# Altium project tsac-distribution.PrjPcb (part 1 of 2)
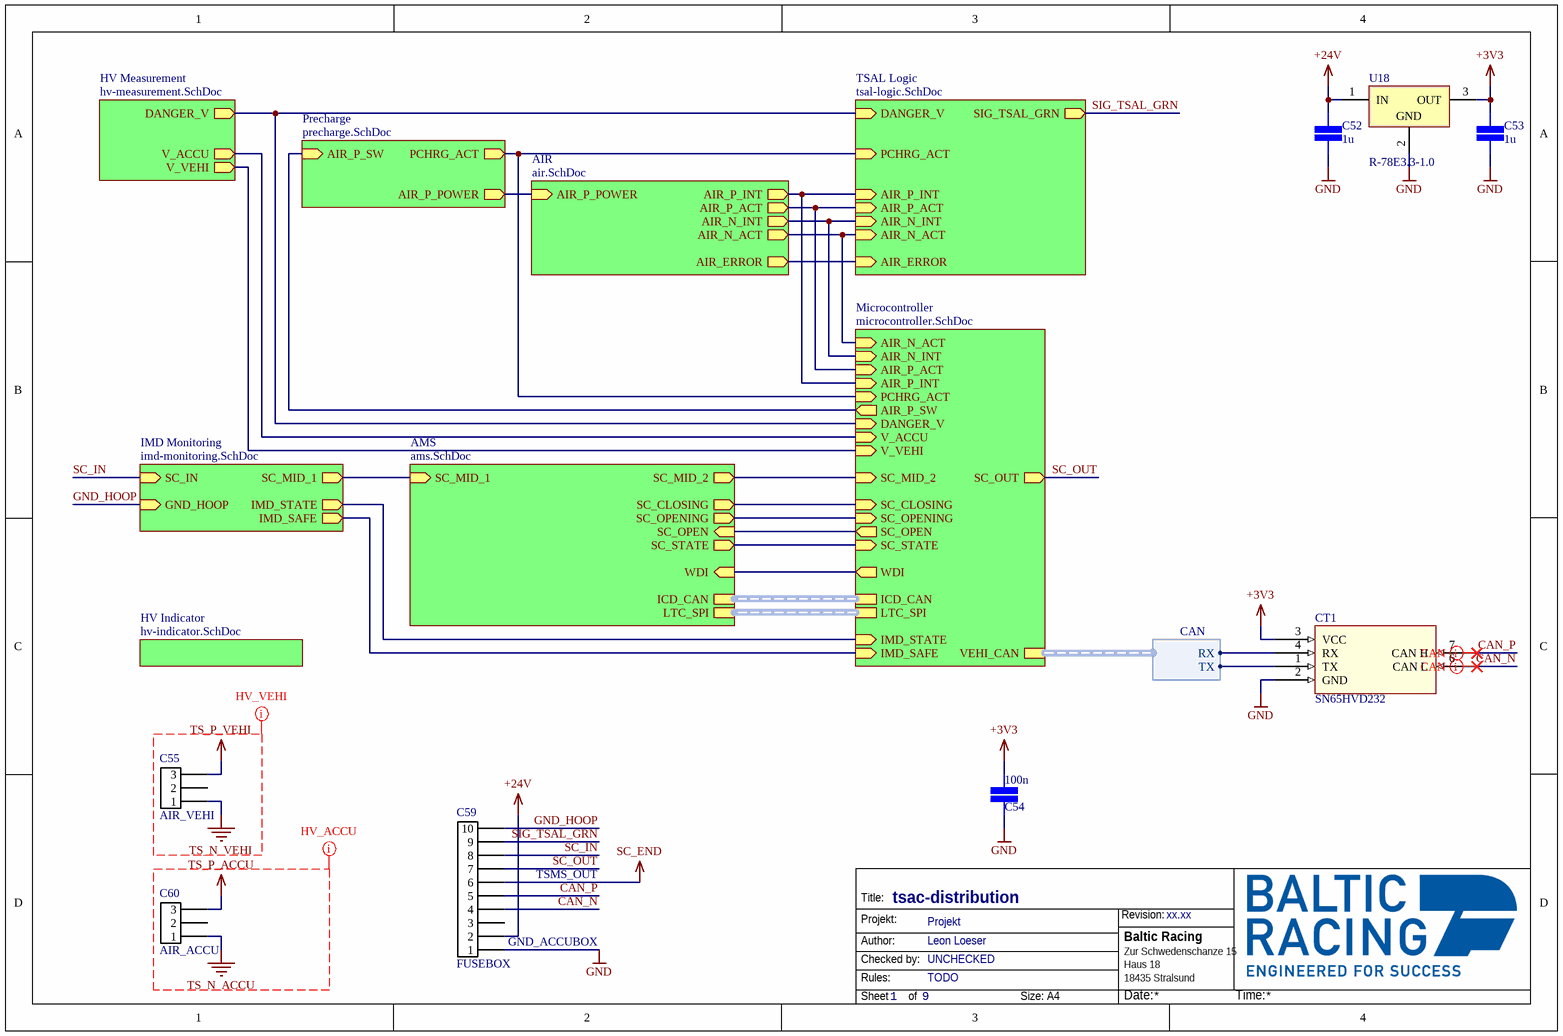
[diagram p0: tsac-distribution.SchDoc]
BoardName: tsac-distribution-board; BoardRevision: 1.0; Organization: Baltic Racing
9 sheets, 218 parts. Net scope: hierarchical (ports join the sheet entries above them; power ports are global).
Board file: tsac-distribution.PcbDoc
Sheets:
  tsac-distribution.SchDoc
    AIR = air.SchDoc
    AMS = ams.SchDoc
    HV Measurement = hv-measurement.SchDoc
    IMD Monitoring = imd-monitoring.SchDoc
    Microcontroller = microcontroller.SchDoc
    TSAL Logic = tsal-logic.SchDoc
    Precharge = precharge.SchDoc
    HV Indicator = hv-indicator.SchDoc

## Sheet tsac-distribution.SchDoc: tsac-distribution
size A4; Date: 05.10.2017; CheckedBy: UNCHECKED; Author: Leon Loeser; Organization: Baltic Racing; Address1: Zur Schwedenschanze 15; Address2: Haus 18; Address3: 18435 Stralsund; Revision: xx.xx; SheetNumber: 1; SheetTotal: 9; Rules: TODO; ProjectName: Projekt

### Parts
C52  value 1u  [CAP 0805/2012]  (hidden comment: SMD Capacitor)
C53  value 1u  [CAP 0805/2012]  (hidden comment: SMD Capacitor)
C54  value 100n  [CAP 0603/1608]  (hidden comment: SMD Capacitor)
C55  AIR_VEHI  [43650-0315]
C59  FUSEBOX  [43045-1012]
C60  AIR_ACCU  [43650-0315]
CT1  SN65HVD232  [SOIC8 CAN-Transceiver]
U18  R-78E3.3-1.0  [SIP3_RECOM]

### Sub-sheets
AIR = air.SchDoc: AIR_P_INT (out), AIR_N_INT (out), AIR_P_POWER (in), AIR_P_ACT (out), AIR_N_ACT (out), AIR_ERROR (out)
AMS = ams.SchDoc: SC_CLOSING (out), SC_OPEN (in), WDI (in), SC_OPENING (out), SC_STATE (out), SC_MID_1 (in), SC_MID_2 (out), ICD_CAN (harness CAN), LTC_SPI (harness SPI)
HV Indicator = hv-indicator.SchDoc: no entries
HV Measurement = hv-measurement.SchDoc: DANGER_V (out), V_ACCU (out), V_VEHI (out)
IMD Monitoring = imd-monitoring.SchDoc: SC_IN (in), IMD_STATE (out), GND_HOOP (in), SC_MID_1 (out), IMD_SAFE (out)
Microcontroller = microcontroller.SchDoc: SC_OPEN (out), SC_CLOSING (in), SC_OPENING (in), ICD_CAN (harness CAN), LTC_SPI (harness SPI), VEHI_CAN (harness CAN), SC_STATE (in), WDI (out), IMD_SAFE (in), IMD_STATE (in), PCHRG_ACT (in), DANGER_V (in), AIR_P_INT (in), AIR_P_ACT (in), AIR_N_INT (in), AIR_N_ACT (in), V_ACCU (in), V_VEHI (in), AIR_P_SW (out), SC_MID_2 (in), SC_OUT (out)
Precharge = precharge.SchDoc: PCHRG_ACT (out), AIR_P_POWER (out), AIR_P_SW (in)
TSAL Logic = tsal-logic.SchDoc: SIG_TSAL_GRN (out), PCHRG_ACT (in), DANGER_V (in), AIR_P_INT (in), AIR_P_ACT (in), AIR_N_INT (in), AIR_N_ACT (in), AIR_ERROR (in)

### Harnesses
CAN: TX, RX

### Nets
+3V3: C53.1 C54.1 CT1.3(VCC) U18.3(OUT)
+24V: C52.1 C59.2 U18.1(IN)
GND: C52.2 C53.2 C54.2 C59.1 CT1.2(GND) U18.2(GND)
SC_END: C59.6
TS_N_ACCU: C60.1
TS_N_VEHI: C55.1
TS_P_ACCU: C60.3
TS_P_VEHI: C55.3
AIR_ERROR: sheet AIR/AIR_ERROR, sheet TSAL Logic/AIR_ERROR
AIR_N_ACT: sheet AIR/AIR_N_ACT, sheet Microcontroller/AIR_N_ACT, sheet TSAL Logic/AIR_N_ACT
AIR_N_INT: sheet AIR/AIR_N_INT, sheet Microcontroller/AIR_N_INT, sheet TSAL Logic/AIR_N_INT
AIR_P_ACT: sheet AIR/AIR_P_ACT, sheet Microcontroller/AIR_P_ACT, sheet TSAL Logic/AIR_P_ACT
AIR_P_INT: sheet AIR/AIR_P_INT, sheet Microcontroller/AIR_P_INT, sheet TSAL Logic/AIR_P_INT
AIR_P_POWER: sheet AIR/AIR_P_POWER, sheet Precharge/AIR_P_POWER
CAN_N: C59.4 CT1.6(CAN_L)
CAN_P: C59.5 CT1.7(CAN_H)
CANRX0: CT1.4(RX) ; sheet Microcontroller/VEHI_CAN.RX
CANTX0: CT1.1(TX) ; sheet Microcontroller/VEHI_CAN.TX
DANGER_V: sheet HV Measurement/DANGER_V, sheet Microcontroller/DANGER_V, sheet TSAL Logic/DANGER_V
GND_HOOP: C59.10 ; sheet IMD Monitoring/GND_HOOP
IMD_SC_CLOSED: sheet IMD Monitoring/IMD_SAFE, sheet Microcontroller/IMD_SAFE
IMD_STATE: sheet IMD Monitoring/IMD_STATE, sheet Microcontroller/IMD_STATE
PCHRG_ACT: sheet Microcontroller/PCHRG_ACT, sheet TSAL Logic/PCHRG_ACT, sheet Precharge/PCHRG_ACT
SC_IN: C59.8 ; sheet IMD Monitoring/SC_IN
SC_OUT: C59.7 ; sheet Microcontroller/SC_OUT
SIG_TSAL_GRN: C59.9 ; sheet TSAL Logic/SIG_TSAL_GRN
V_ACCU: sheet HV Measurement/V_ACCU, sheet Microcontroller/V_ACCU
V_VEHI: sheet HV Measurement/V_VEHI, sheet Microcontroller/V_VEHI
WDI: sheet AMS/WDI, sheet Microcontroller/WDI
NetD3_2: sheet AMS/SC_CLOSING, sheet Microcontroller/SC_CLOSING
NetD4_1: sheet AMS/SC_STATE, sheet Microcontroller/SC_STATE
NetD5_1: sheet AMS/SC_OPEN, sheet Microcontroller/SC_OPEN
NetD7_1: sheet AMS/SC_OPENING, sheet Microcontroller/SC_OPENING
NetQ4_3: sheet AMS/SC_MID_1, sheet IMD Monitoring/SC_MID_1
NetQ6_3: sheet AMS/SC_MID_2, sheet Microcontroller/SC_MID_2
NetR19_1: sheet Microcontroller/AIR_P_SW, sheet Precharge/AIR_P_SW

Not connected (* = marked no-connect by the designer): C55 2; C59 3; C60 2; CT1 5(NC) 8(NC)

### Buses and harness runs
harness sheet AMS/ICD_CAN = sheet Microcontroller/ICD_CAN
harness sheet AMS/LTC_SPI = sheet Microcontroller/LTC_SPI

### Layout directives
differential pair: CAN_N, CAN_P
net class HV_VEHI: TS_N_VEHI, TS_P_VEHI
net class HV_ACCU: TS_N_ACCU, TS_P_ACCU

### Notes on the sheet
- TSMS_OUT
- GND_ACCUBOX
- Title:
- Projekt:
- Revision:
- Author:
- Rules:
- Checked by:
- Sheet
- of
- Size:
- A4
- Date:
- Time:

### Library data of the parts
C52 = SMD Capacitor: Capacitor with multiple Footprints; Voltage: 25V
C53 C54 = SMD Capacitor: Capacitor with multiple Footprints; Voltage: 6.3V
C55 C60 = MicroFit3.0 3-Pin: Molex MicroFit3.0 3-Pin
C59 = MicroFit3.0 10-Pin: Micro-Fit 3.0 10-Pin / 600V / 8.5V
CT1 = SN65HVD232: Standard CAN-Transciever 3.3V
U18 = R-78E3.3-1.0: Nonisolated 3.3V Switchmode converter

## Sheet air.SchDoc: air
size A4; Date: 05.10.2017; CheckedBy: Nico Bieberich; Author: Leon Loeser; Organization: Baltic Racing; Address1: Zur Schwedenschanze 15; Address2: Haus 18; Address3: 18435 Stralsund; Revision: xx.xx; SheetNumber: 7; SheetTotal: 9; Rules: TODO; ProjectName: Projekt
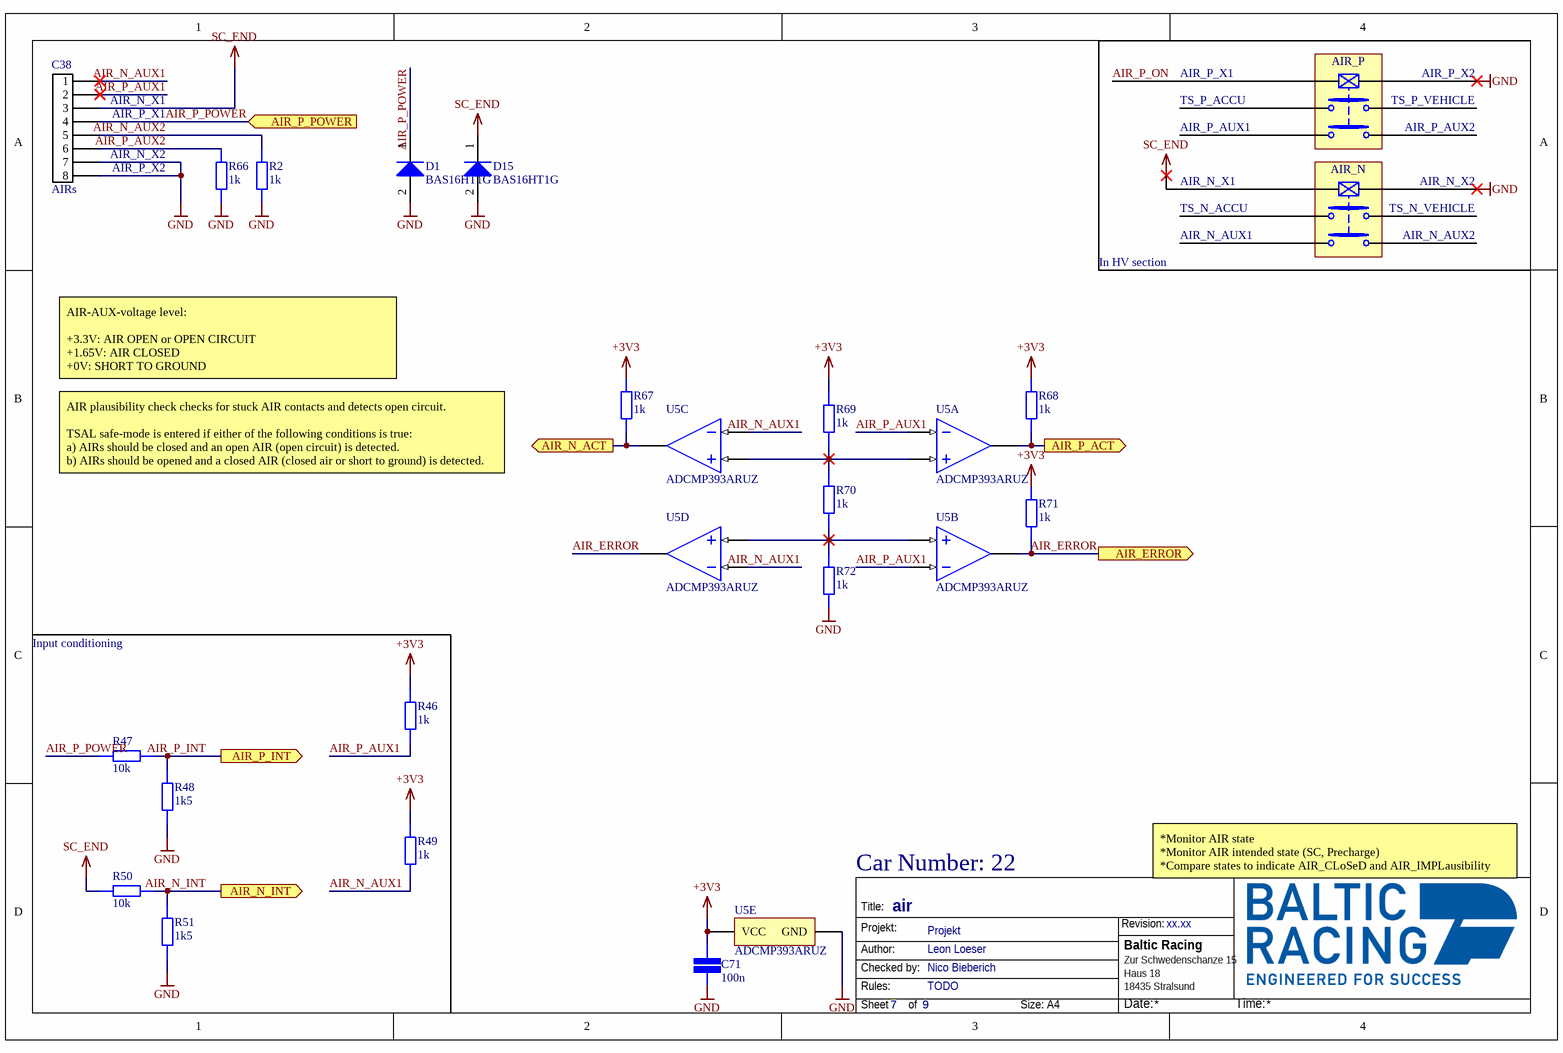
[diagram p1: air.SchDoc]

### Parts
C38  AIRs  [43045-0812]
C71  value 100n  [CAP 0603/1608]  (hidden comment: SMD Capacitor)
D1  BAS16HT1G  [ONSC-SOD-323-2-477-02_V]
D15  BAS16HT1G  [ONSC-SOD-323-2-477-02_V]
R2  value 1k  [STACKPOLE CSR0603]  (hidden comment: SMD Resistor)
R46  value 1k  [STACKPOLE CSR0603]  (hidden comment: SMD Resistor)
R47  value 10k  [STACKPOLE CSR0603]  (hidden comment: SMD Resistor)
R48  value 1k5  [STACKPOLE CSR0603]  (hidden comment: SMD Resistor)
R49  value 1k  [STACKPOLE CSR0603]  (hidden comment: SMD Resistor)
R50  value 10k  [STACKPOLE CSR0603]  (hidden comment: SMD Resistor)
R51  value 1k5  [STACKPOLE CSR0603]  (hidden comment: SMD Resistor)
R66  value 1k  [STACKPOLE CSR0603]  (hidden comment: SMD Resistor)
R67  value 1k  [STACKPOLE CSR0603]  (hidden comment: SMD Resistor)
R68  value 1k  [STACKPOLE CSR0603]  (hidden comment: SMD Resistor)
R69  value 1k  [STACKPOLE CSR0603]  (hidden comment: SMD Resistor)
R70  value 1k  [STACKPOLE CSR0603]  (hidden comment: SMD Resistor)
R71  value 1k  [STACKPOLE CSR0603]  (hidden comment: SMD Resistor)
R72  value 1k  [STACKPOLE CSR0603]  (hidden comment: SMD Resistor)
U5  ADCMP393ARUZ  [ANALOG_RU14]  (parts A,B,C,D,E of 5)

### Ports
AIR_ERROR (out), AIR_N_ACT (out), AIR_N_INT (out), AIR_P_ACT (out), AIR_P_INT (out), AIR_P_POWER (in)

### Nets
+3V3: C71.1 R46.2 R49.2 R67.2 R68.2 R69.2 R71.2 U5.3(VCC)
GND: C38.7 C38.8 C71.2 D1.2(A) D15.2(A) R2.1 R48.1 R51.1 R66.1 R72.1 U5.12(GND)
SC_END: C38.3 D15.1(K) R50.2
AIR_ERROR: R71.1 U5.1(OUT_B) U5.13(OUT_D) ; port AIR_ERROR
AIR_N_ACT: R67.1 U5.14(OUT_C) ; port AIR_N_ACT
AIR_N_AUX1: C38.1 R49.1 U5.8(-IN_C) U5.10(-IN_D)
AIR_N_AUX2: C38.5 R2.2
AIR_N_INT: R50.1 R51.2 ; port AIR_N_INT
AIR_P_ACT: R68.1 U5.2(OUT_A) ; port AIR_P_ACT
AIR_P_AUX1: C38.2 R46.1 U5.4(-IN_A) U5.6(-IN_B)
AIR_P_AUX2: C38.6 R66.2
AIR_P_INT: R47.1 R48.2 ; port AIR_P_INT
AIR_P_POWER: C38.4 D1.1(K) R47.2 ; port AIR_P_POWER
NetR69_1: R69.1 R70.2 U5.5(+IN_A) U5.9(+IN_C)
NetR70_1: R70.1 R72.2 U5.7(+IN_B) U5.11(+IN_D)

### Notes on the sheet
- (near C38) AIR_N_X1
- AIR_P_X1
- AIR_P_ON
- TS_P_ACCU
- AIR_P
- TS_P_VEHICLE
- AIR_P_X2
- AIR_N_X2
- AIR_P_AUX1
- AIR_N_X1
- AIR_N
- AIR_P_AUX2
- TS_N_ACCU
- AIR_N_AUX1
- TS_N_VEHICLE
- AIR_N_AUX2
- In HV section
- AIR-AUX-voltage level:
  +3.3V: AIR OPEN or OPEN CIRCUIT
  +1.65V: AIR CLOSED
  +0V: SHORT TO GROUND
- AIR plausibility check checks for stuck AIR contacts and detects open circuit.
  TSAL safe-mode is entered if either of the following conditions is true:
  a) AIRs should be closed and an open AIR (open circuit) is detected.
  b) AIRs should be opened and a closed AIR (closed air or short to ground) is detected.
- Input conditioning
- Car Number: 22
- *Monitor AIR state
  *Monitor AIR intended state (SC, Precharge)
  *Compare states to indicate AIR_CLoSeD and AIR_IMPLausibility
  *Generate SIG_TSAL
- Labels drawn without touching a wire or pin: GND, SC_END
- Title:
- Projekt:
- Revision:
- Author:
- Rules:
- Checked by:
- Sheet
- of
- Size:
- A4
- Date:
- Time:

### Library data of the parts
C38 = MicroFit3.0 8-Pin: Molex Micro-Fit 3.0 8-Pin / 600V / 8.5V
C71 = SMD Capacitor: Capacitor with multiple Footprints
D1 D15 = CMP-1054-00068-1: Switching Diode, 2-Pin SOD-323, Pb-Free, Tape and Reel; Manufacturer: On Semiconductor; Configuration: Single; IF Max (A): 0.2; trr Max (ns): 6; Packing: Tape and Reel; ComponentLink2URL: http://www.onsemi.com/pub_link/Collateral/BAS16HT1-D.PDF; ComponentLink3Description: Package Specification; RoHS: TRUE; PackageDescription: 2-Pin SOD, Body 1.7 x 1.25 mm; PackageReference: SOD-323-2-477-02; PartNumber: BAS16HT1G; ComponentLink1URL: http://www.onsemi.com/; Mounting Technology: Surface Mount; ComponentLink1Description: Manufacturer URL; ComponentLink2Description: Datasheet; DatasheetVersion: Rev. 11; PackageVersion: Rev. H, 03/2007; ComponentLink3URL: http://www.onsemi.com/pub_link/Collateral/477-02.PDF.1
R2 R46-R51 R66-R72 = SMD Resistor: Resistor with multiple footprints
U5 = ADCMP393ARUZ: 2.3V-5.5V Quad Comparator With Known Power-Up State and Open-Drain output

## Sheet ams.SchDoc: ams-master
size A4; Date: 05.10.2017; CheckedBy: UNCHECKED; Author: Leon Loeser; Organization: Baltic Racing; Address1: Zur Schwedenschanze 15; Address2: Haus 18; Address3: 18435 Stralsund; Revision: xx.xx; SheetNumber: 2; SheetTotal: 9; Rules: EV5.8; ProjectName: Projekt
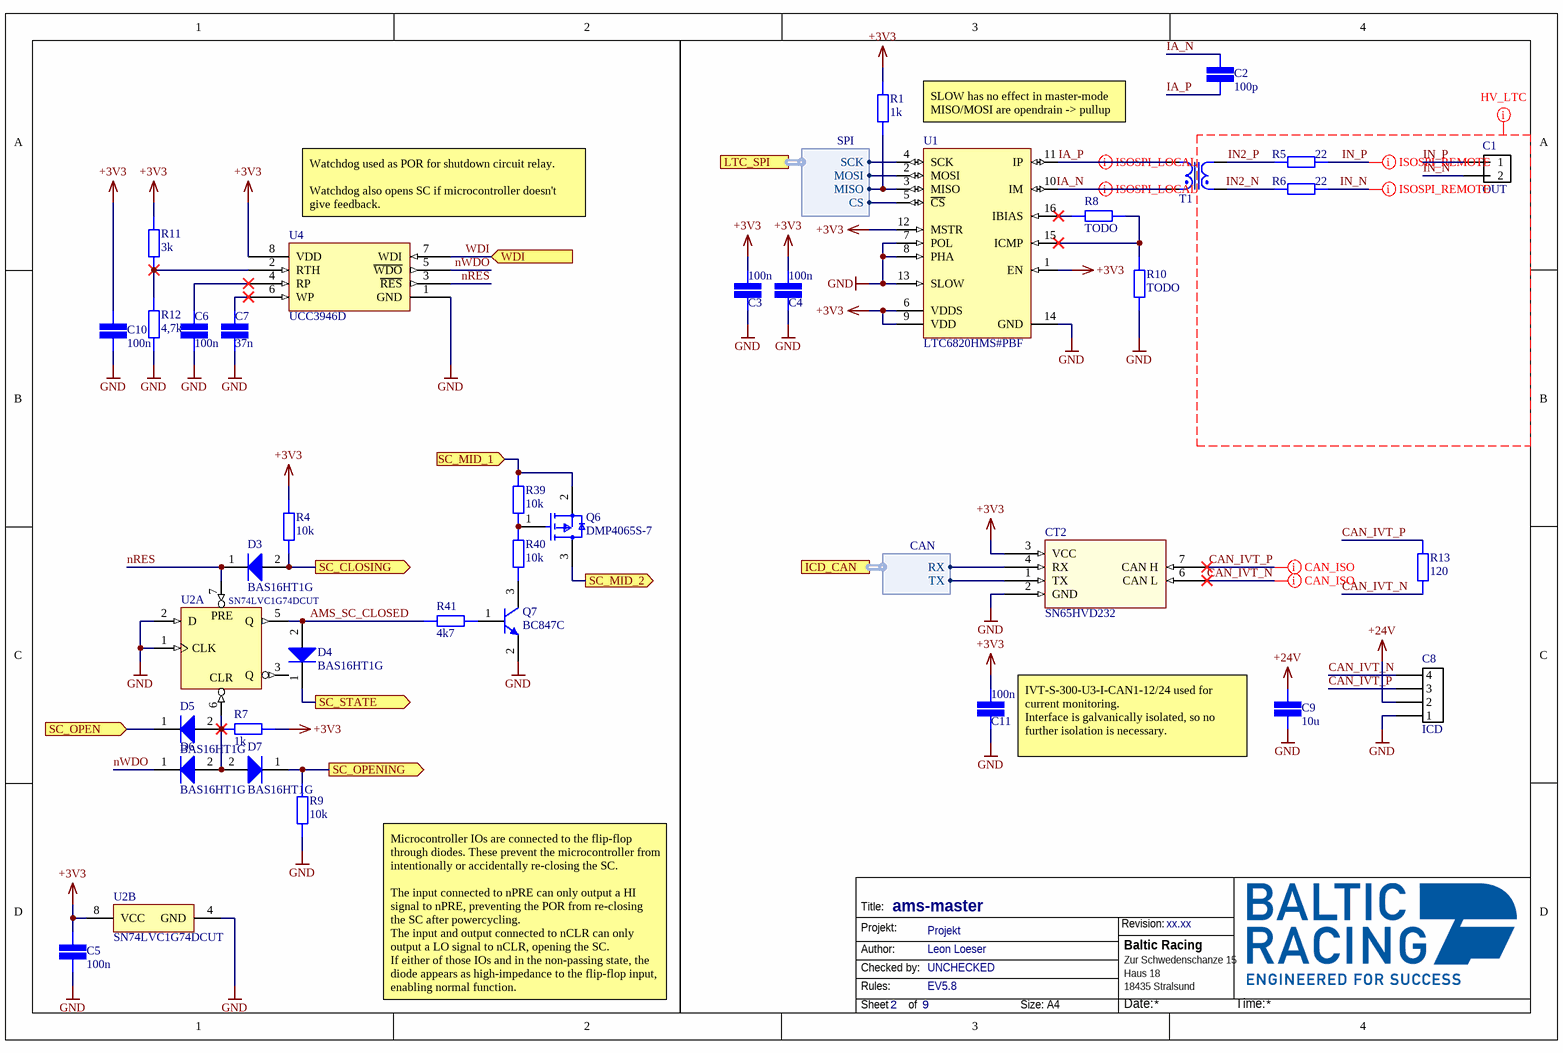
[diagram p2: ams.SchDoc]

### Parts
C1  OUT  [43045-0212]
C2  value 100p  [CAP 0603/1608]  (hidden comment: SMD Capacitor)
C3  value 100n  [CAP 0603/1608]  (hidden comment: SMD Capacitor)
C4  value 100n  [CAP 0603/1608]  (hidden comment: SMD Capacitor)
C5  value 100n  [CAP 0603/1608]  (hidden comment: SMD Capacitor)
C6  value 100n  [CAP 0603/1608]  (hidden comment: SMD Capacitor)
C7  value 37n  [CAP 0603/1608]  (hidden comment: SMD Capacitor)
C8  ICD  [43045-0412]
C9  value 10u  [CAP 1206/3216]  (hidden comment: SMD Capacitor)
C10  value 100n  [CAP 0603/1608]  (hidden comment: SMD Capacitor)
C11  value 100n  [CAP 0603/1608]  (hidden comment: SMD Capacitor)
CT2  SN65HVD232  [SOIC8 CAN-Transceiver]
D3  BAS16HT1G  [ONSC-SOD-323-2-477-02_V]
D4  BAS16HT1G  [ONSC-SOD-323-2-477-02_V]
D5  BAS16HT1G  [ONSC-SOD-323-2-477-02_V]
D6  BAS16HT1G  [ONSC-SOD-323-2-477-02_V]
D7  BAS16HT1G  [ONSC-SOD-323-2-477-02_V]
Q6  DMP4065S-7  [FP-SOT23-MFG]
Q7  BC847C  [INF-SOT23_L]
R1  value 1k  [STACKPOLE CSR0603]  (hidden comment: SMD Resistor)
R4  value 10k  [STACKPOLE CSR0603]  (hidden comment: SMD Resistor)
R5  value 22  [STACKPOLE CSR0603]  (hidden comment: SMD Resistor)
R6  value 22  [STACKPOLE CSR0603]  (hidden comment: SMD Resistor)
R7  value 1k  [STACKPOLE CSR0603]  (hidden comment: SMD Resistor)
R8  value TODO  [STACKPOLE CSR0603]  (hidden comment: SMD Resistor)
R9  value 10k  [STACKPOLE CSR0603]  (hidden comment: SMD Resistor)
R10  value TODO  [STACKPOLE CSR0603]  (hidden comment: SMD Resistor)
R11  value 3k  [STACKPOLE CSR0603]  (hidden comment: SMD Resistor)
R12  value 4,7k  [STACKPOLE CSR0603]  (hidden comment: SMD Resistor)
R13  value 120  [STACKPOLE CSR0603]  (hidden comment: SMD Resistor)
R39  value 10k  [STACKPOLE CSR0603]  (hidden comment: SMD Resistor)
R40  value 10k  [STACKPOLE CSR0603]  (hidden comment: SMD Resistor)
R41  value 4k7  [STACKPOLE CSR0603]  (hidden comment: SMD Resistor)
T1  750110055  [Wuerth_750110055]  (value not drawn)
U1  LTC6820HMS#PBF  [LT-MS-16_M]
U2  SN74LVC1G74DCUT  [DCU0008A_L]  (parts A,B of 2)
U4  UCC3946D  [SOIC8]

### Ports
ICD_CAN (harness CAN), LTC_SPI (harness SPI), SC_CLOSING (out), SC_MID_1 (in), SC_MID_2 (out), SC_OPEN (in), SC_OPENING (out), SC_STATE (out), WDI (in)

### Harnesses
SPI: SCK, MOSI, MISO, CS
CAN: TX, RX

### Nets
+3V3: C3.1 C4.1 C5.1 C10.2 C11.1 CT2.3(VCC) R1.2 R4.1 R7.2 R11.1 U1.1(EN) U1.6(VDDS) U1.9(VDD) U1.12(MSTR) U2.8(VCC) U4.8(VDD)
+24V: C8.2 C9.2
GND: C3.2 C4.2 C5.2 C6.1 C7.1 C8.1 C9.1 C10.1 C11.2 CT2.2(GND) Q7.2(E) R9.2 R10.1 R12.2 U1.7(POL) U1.8(PHA) U1.13(SLOW) U1.14(GND) U2.1(CLK) U2.2(D) U2.4(GND) U4.1(GND)
AMS_SC_CLOSED: D4.2(A) R41.2 U2.5(Q)
CAN_IVT_N: C8.4 CT2.6(CAN_L) R13.1
CAN_IVT_P: C8.3 CT2.7(CAN_H) R13.2
CANRX1: CT2.4(RX) ; port ICD_CAN.RX
CANTX1: CT2.1(TX) ; port ICD_CAN.TX
IA_N: C2.2 T1.1 U1.10(IM)
IA_P: C2.1 T1.2 U1.11(IP)
IN2_N: R6.1 T1.4
IN2_P: R5.1 T1.3
IN_N: C1.2 R6.2
IN_P: C1.1 R5.2
nRES: D3.1(K) U2.7(~{PRE}) U4.3(~{RES})
nWDO: D6.1(K) U4.5(~{WDO})
SPI3_MISO: R1.1 U1.3(MISO) ; port LTC_SPI.MISO
SPI3_MOSI: U1.2(MOSI) ; port LTC_SPI.MOSI
SPI3_NSS: U1.5(~{CS}) ; port LTC_SPI.CS
SPI3_SCK: U1.4(SCK) ; port LTC_SPI.SCK
WDI: U4.7(WDI) ; port WDI
NetC6_2: C6.2 U4.4(RP)
NetC7_2: C7.2 U4.6(WP)
NetD3_2: D3.2(A) R4.2 ; port SC_CLOSING
NetD4_1: D4.1(K) ; port SC_STATE
NetD5_1: D5.1(K) ; port SC_OPEN
NetD5_2: D5.2(A) D6.2(A) D7.2(A) R7.1 U2.6(~{CLR})
NetD7_1: D7.1(K) R9.1 ; port SC_OPENING
NetQ4_3: Q6.2(S) R39.1 ; port SC_MID_1
NetQ6_1: Q6.1(G) R39.2 R40.1
NetQ6_3: Q6.3(D) ; port SC_MID_2
NetQ7_1: Q7.1(B) R41.1
NetQ7_3: Q7.3(C) R40.2
NetR8_1: R8.1 R10.2 U1.15(ICMP)
NetR8_2: R8.2 U1.16(IBIAS)
NetR11_2: R11.2 R12.1 U4.2(RTH)

Not connected (* = marked no-connect by the designer): CT2 5(NC) 8(NC); U2 3(Q)

### Layout directives
differential pair: CAN_IVT_N, CAN_IVT_P, IA_N, IA_P, IN_N, IN_P
net class HV_LTC: IN2_N, IN2_P, IN_N, IN_P

### Notes on the sheet
- SLOW has no effect in master-mode
  MISO/MOSI are opendrain -> pullup
- (near U4) Watchdog used as POR for shutdown circuit relay.
  Watchdog also opens SC if microcontroller doesn't give feedback.
- IVT-S-300-U3-I-CAN1-12/24 used for current monitoring.
  Interface is galvanically isolated, so no further isolation is necessary.
- Microcontroller IOs are connected to the flip-flop through diodes. These prevent the microcontroller from intentionally or accidentally re-closing the SC.
  The input connected to nPRE can only output a HI signal to nPRE, preventing the POR from re-closing the SC after powercycling.
  The input and output connected to nCLR can only output a LO signal to nCLR, opening the SC.
  If either of those IOs and in the non-passing state, the diode appears as high-impedance to the flip-flop input, enabling normal function.
- Title:
- Projekt:
- Revision:
- Author:
- Rules:
- Checked by:
- Sheet
- of
- Size:
- A4
- Date:
- Time:
- (in symbol CMP-0859-00687-1, part A) PRE; CLR

### Library data of the parts
C1 = MicroFit3.0 2-Pin: Molex MicroFit3.0 2-Pin
C2-C7 C10 = SMD Capacitor: as C53 on sheet tsac-distribution
C8 = MicroFit3.0 4-Pin: Molex Micro-Fit 3.0 4-Pin / 600V / 8.5V
C9 C11 = SMD Capacitor: Capacitor with multiple Footprints
CT2 = SN65HVD232: Standard CAN-Transciever 3.3V
D3-D7 = CMP-1054-00068-1: as D1 on sheet air; Packing: Tape and Reel; ComponentLink2URL: http://www.onsemi.com/pub_link/Collateral/BAS16HT1-D.PDF; ComponentLink3Description: Package Specification; RoHS: TRUE; PackageDescription: 2-Pin SOD, Body 1.7 x 1.25 mm; PackageReference: SOD-323-2-477-02; PartNumber: BAS16HT1G; ComponentLink1URL: http://www.onsemi.com/; Mounting Technology: Surface Mount; ComponentLink1Description: Manufacturer URL; ComponentLink2Description: Datasheet; DatasheetVersion: Rev. 11; PackageVersion: Rev. H, 03/2007; ComponentLink3URL: http://www.onsemi.com/pub_link/Collateral/477-02.PDF.1
Q6 = CMP-12801-000050-1: MOSFET P-CH 40V 2.4A SOT23; Manufacturer: Diodes Inc.; Number Of Channels: 1; Max Junction Temp: +150°C; Standoff Height: 0.013mm; Power Dissipation: 0.72W; Turn Off Delay Time: 36.3ns; Rthja Max: 171°C/W; Typ Forward Diode Voltage: -0.7V; Max Forward Diode Voltage: -1.2V; Drain To Source Voltage: -40V; Threshold Vgs Min: -1V; Gate To Source Voltage: 20V; Depletion Mode: False; Input Capacitace At Vds: 587pF @ -20V; Drain To Source Resistance: 64mΩ; Turn On Delay Time: 3.6ns; Continuous Drain Current: -2.4A; Pulse Drain Current: -20A; Gate Charge At Vgs: 12.2nC @ -10V; Threshold Vgs Max: -3V; Octopart: https://octopart.com/dmp4065s-7-diodes+inc.-57605044; Footprint Url: https://www.diodes.com/assets/Package-Files/SOT23.pdf; Device Class L2: Transistors; Package: SOT23; Number Of P Channels: 1; ComponentLink2URL: https://www.diodes.com/assets/Datasheets/DMP4065S.pdf; Temperature Range High: +150°C; Device Class L1: Discrete Semiconductors; Temperature Range Low: -55°C; Manufacturer Part Number: DMP4065S-7; ComponentLink2Description: Datasheet; Lead Free: Yes; Temperature: -55°C to +150°C; Drain To Source Breakdown Voltage: -40V; Category: Trans; Height: 1.1mm; Digikey Description: MOSFET P-CH 40V 2.4A SOT23; Ipc Land Pattern Name: SOT92P240X102-3; Device Class L3: MOSFETs; RoHS: TRUE; Mouser Description: Trans MOSFET P-CH 40V 2.4A Automotive 3-Pin SOT-23 T/R; Automotive: No
Q7 = CMP-1177-00037-1: NPN Silicon AF Transistor, 45 V VCEO, 100 mA IC, SOT23, Reel, Green; Manufacturer: Infineon; VCEO (max): 45Â V; VEBO (max): 6Â V; fT (typ): 250Â MHz; VCBO (max): 50Â V; ICM (max): 200Â mA; Green: TRUE; IC (max): 100Â mA; Ptot (max): 330Â mW; ICBO (max): 15Â nA; PartNumber: BC847C; ComponentLink3URL: http://www.infineon.com/dgdl/SOT23-Package_Overview.pdf?folderId=db3a30431936bc4b0119532290053c66&fileId=db3a30431936bc4b0119533468123c85; ComponentLink3Description: Package Specification; Mounting Technology: Surface Mount; PackageDescription: 3-Pin Small Outline Transistor Package, 1.3 x 2.9 mm Body, 0.95 mm Pitch; PackageReference: SOT23; ComponentLink2URL: http://www.infineon.com/dgdl/bc847series_bc848series_bc849series_bc850series.pdf?folderId=db3a304314dca389011541d30fa21656&fileId=db3a304314dca389011541d4630a1657; ComponentLink2Description: Datasheet; ComponentLink1Description: Manufacturer URL; Polarity: NPN; ComponentLink1URL: http://www.infineon.com/; IBM (max): 200Â mA; Packing: Reel; PackageVersion: Apr-08
R1 R4-R13 R39-R41 = SMD Resistor: Resistor with multiple footprints
T1 = Wuerth_Transformer_750110055: Würth Toroid Transformer 1:1 70µH; Order Nr.: 750312504; Hersteller: Würth
U1 = CMP-0937-00009-1: IsoSPI Isolated Communication Interface, 2.7 to 5.5 V, -40 to 125 degC, 16-Pin MSOP (MS), Pb-Free; Manufacturer: Linear Technology; IO Supply Current: 1 uA Max.; IO Supply Voltage Range: 1.7 to 5.5 V; Receiver Input Resistance: 35 kOhm; VBIAS: 1.9 to 2.1 V; Supply Current, IDLE State: 2 uA; ComponentLink3Description: Package Specification; Mounting Technology: Surface Mount; ComponentLink2URL: http://cds.linear.com/docs/en/datasheet/6820fa.pdf; PackageVersion: Rev. A; PackageReference: MS-16; PackageDescription: 16-Pin Micro Small Outline Package, Body 4.039 x 3 mm, Pitch 0.5 mm; ComponentLink3URL: http://cds.linear.com/docs/en/packaging/05081669_A_MS16.pdf; DatasheetVersion: Rev. A; Power Supply: 2.7 to 5.5 V; ComponentLink1Description: Manufacturer URL; PartNumber: LTC6820HMS#PBF; Temperature Range (degC): -40 to 125; ComponentLink1URL: http://www.linear.com/; ComponentLink2Description: Datasheet
U2 = CMP-0859-00687-1: Single Positive-Edge-Triggered D-Type Flip-Flop With Clear and Preset, DCU0008A, SMALL T&R; Schmitt Trigger: No; Technology Family: LVC; VCC(Min)(V): 1.65; F @ Nom Voltage(Max)(Mhz): 150; ICC @ Nom Voltage(Max)(mA): 0.01; Voltage(Nom)(V): 1.8,2.5,3.3,5; VCC(Max)(V): 5.5; Output Type: CMOS; Logic: True; tpd @ Nom Voltage(Max)(ns): 13.4,7.1,5.9,4.1; Input Type: CMOS/TTL; Output Drive (IOL/IOH)(Max)(mA): 32/-32; Rating: Catalog; Bits(#): 1; Operating Temperature Range(C): -40 to 125; PackageReference: DCU0008A; ComponentLink2Description: Datasheet; DatasheetVersion: SCES794E; Part Number: SN74LVC1G74; Sub-Family: D-Type Flip-Flop; ComponentLink1URL: http://www.ti.com/; PartNumber: SN74LVC1G74DCUT; ComponentLink2URL: http://www.ti.com/lit/ds/symlink/sn74lvc1g74.pdf; ComponentLink1Description: Manufacturer URL; 3-State Output: No
U4 = UCC3946: Microprocessor supervisor with watchdog timer

## Sheet hv-measurement.SchDoc: hv-measurement
size A4; Date: 05.10.2017; CheckedBy: Nico Bieberich; Author: Leon Loeser; Organization: Baltic Racing; Address1: Zur Schwedenschanze 15; Address2: Haus 18; Address3: 18435 Stralsund; Revision: xx.xx; SheetNumber: 5; SheetTotal: 9; Rules: TODO; ProjectName: Projekt
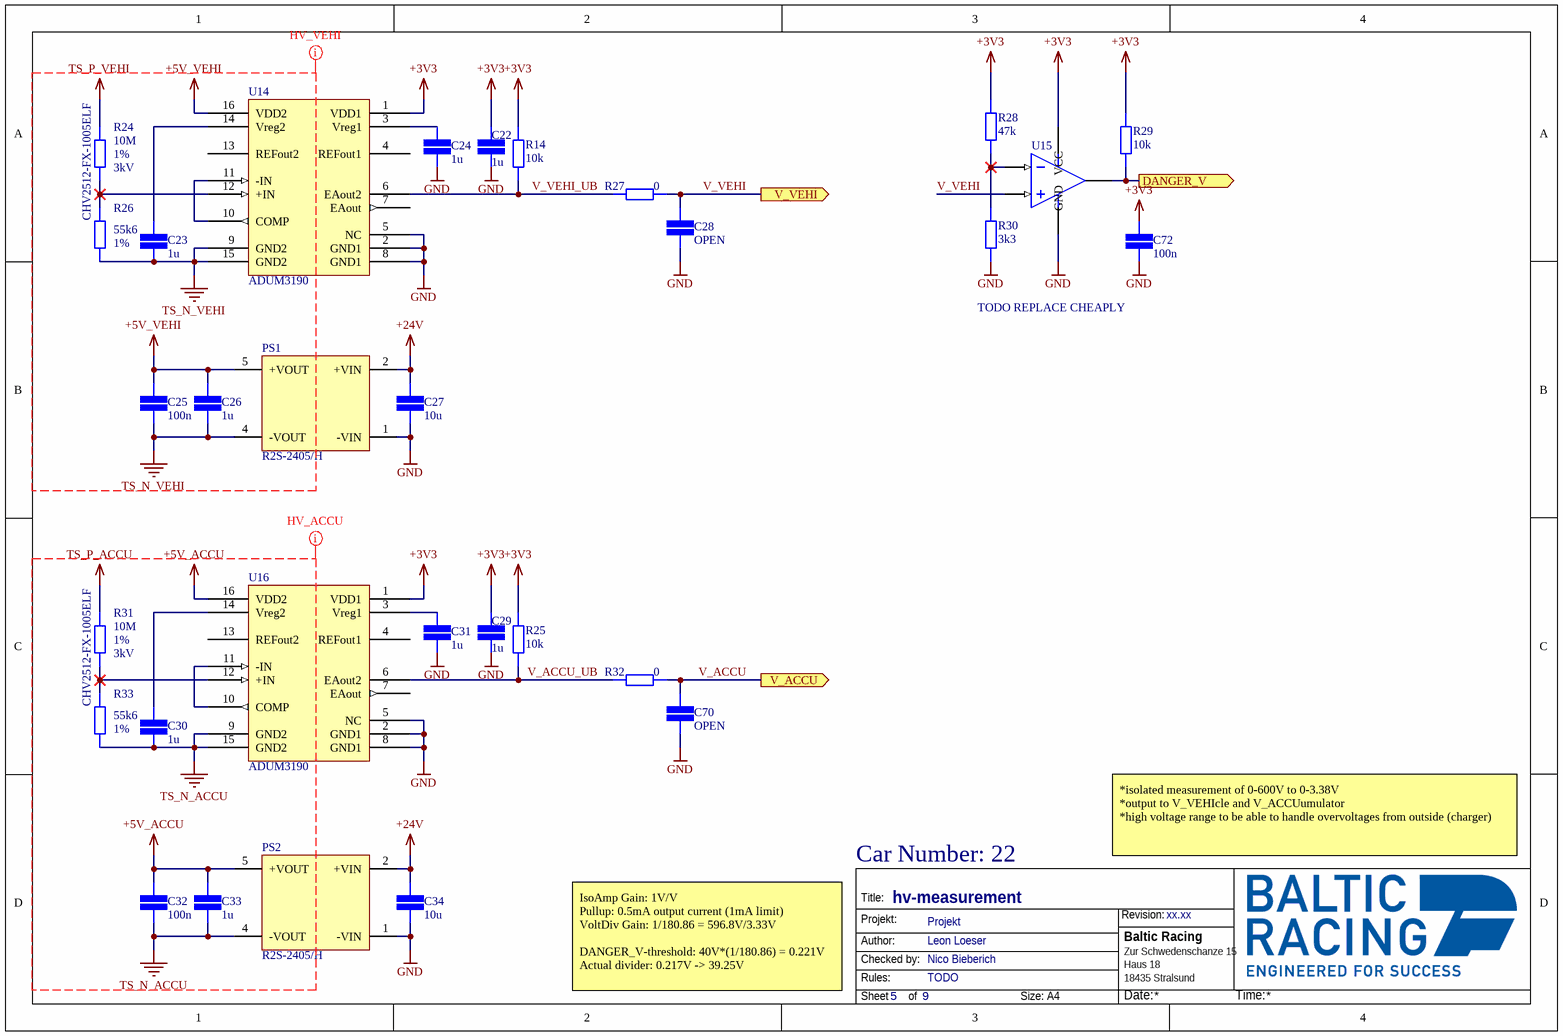
[diagram p3: hv-measurement.SchDoc]

### Parts
C22  value 1u  [CAP 0805/2012]  (hidden comment: SMD Capacitor)
C23  value 1u  [CAP 0805/2012]  (hidden comment: SMD Capacitor)
C24  value 1u  [CAP 0805/2012]  (hidden comment: SMD Capacitor)
C25  value 100n  [CAP 0603/1608]  (hidden comment: SMD Capacitor)
C26  value 1u  [CAP 0805/2012]  (hidden comment: SMD Capacitor)
C27  value 10u  [CAP 1206/3216]  (hidden comment: SMD Capacitor)
C28  value OPEN  [CAP 1206/3216]  (hidden comment: SMD Capacitor)
C29  value 1u  [CAP 0805/2012]  (hidden comment: SMD Capacitor)
C30  value 1u  [CAP 0805/2012]  (hidden comment: SMD Capacitor)
C31  value 1u  [CAP 0805/2012]  (hidden comment: SMD Capacitor)
C32  value 100n  [CAP 0603/1608]  (hidden comment: SMD Capacitor)
C33  value 1u  [CAP 0805/2012]  (hidden comment: SMD Capacitor)
C34  value 10u  [CAP 1206/3216]  (hidden comment: SMD Capacitor)
C70  value OPEN  [CAP 1206/3216]  (hidden comment: SMD Capacitor)
C72  value 100n  [CAP 0603/1608]  (hidden comment: SMD Capacitor)
PS1  R2S-2405/H  [RECOM_R2S]
PS2  R2S-2405/H  [RECOM_R2S]
R14  value 10k  [STACKPOLE CSR0603]  (hidden comment: SMD Resistor)
R24  CHV2512-FX-1005ELF  Tolerance: 1%  Working Voltage: 3kV  Resistance: 10M  [BOURNS_CHV2512]
R25  value 10k  [STACKPOLE CSR0603]  (hidden comment: SMD Resistor)
R26  value 55k6  Tolerance: 1%  [STACKPOLE CSR0603]  (hidden comment: SMD Resistor)
R27  value 0  [STACKPOLE CSR0603]  (hidden comment: SMD Resistor)
R28  value 47k  [STACKPOLE CSR0603]  (hidden comment: SMD Resistor)
R29  value 10k  [STACKPOLE CSR0603]  (hidden comment: SMD Resistor)
R30  value 3k3  [STACKPOLE CSR0603]  (hidden comment: SMD Resistor)
R31  CHV2512-FX-1005ELF  Tolerance: 1%  Working Voltage: 3kV  Resistance: 10M  [BOURNS_CHV2512]
R32  value 0  [STACKPOLE CSR0603]  (hidden comment: SMD Resistor)
R33  value 55k6  Tolerance: 1%  [STACKPOLE CSR0603]  (hidden comment: SMD Resistor)
U14  ADUM3190  [AD_RQ_16]
U15  TODO REPLACE CHEAPLY  [ANALOG_R8]
U16  ADUM3190  [AD_RQ_16]

### Ports
DANGER_V (out), V_ACCU (out), V_VEHI (out)

### Nets
+3V3: C22.1 C29.1 C72.1 R14.2 R25.2 R28.2 R29.2 U14.1(VDD1) U15.7(VCC) U16.1(VDD1)
+5V_ACCU: C32.1 C33.1 PS2.5(+VOUT) U16.16(VDD2)
+5V_VEHI: C25.1 C26.1 PS1.5(+VOUT) U14.16(VDD2)
+24V: C27.2 C34.2 PS1.2(+VIN) PS2.2(+VIN)
GND: C22.2 C24.2 C27.1 C28.2 C29.2 C31.2 C34.1 C70.2 C72.2 PS1.1(-VIN) PS2.1(-VIN) R30.1 U14.2(GND1) U14.5(NC) U14.8(GND1) U15.4(GND) U16.2(GND1) U16.5(NC) U16.8(GND1)
TS_N_ACCU: C30.2 C32.2 C33.2 PS2.4(-VOUT) R33.1 U16.9(GND2) U16.15(GND2)
TS_N_VEHI: C23.2 C25.2 C26.2 PS1.4(-VOUT) R26.1 U14.9(GND2) U14.15(GND2)
TS_P_ACCU: R31.2
TS_P_VEHI: R24.2
DANGER_V: R29.1 U15.6(OUT) ; port DANGER_V
V_ACCU: C70.1 R32.1 ; port V_ACCU
V_ACCU_UB: R25.1 R32.2 U16.6(EAout2)
V_VEHI: C28.1 R27.1 U15.3(+IN) ; port V_VEHI
V_VEHI_UB: R14.1 R27.2 U14.6(EAout2)
NetC23_1: C23.1 U14.14(Vreg2)
NetC24_1: C24.1 U14.3(Vreg1)
NetC30_1: C30.1 U16.14(Vreg2)
NetC31_1: C31.1 U16.3(Vreg1)
NetR24_1: R24.1 R26.2 U14.12(+IN)
NetR28_1: R28.1 R30.2 U15.2(-IN)
NetR31_1: R31.1 R33.2 U16.12(+IN)
NetU14_10: U14.10(COMP) U14.11(-IN)
NetU16_10: U16.10(COMP) U16.11(-IN)

Not connected (* = marked no-connect by the designer): U14 4(REFout1) 7(EAout) 13(REFout2); U16 4(REFout1) 7(EAout) 13(REFout2)

### Layout directives
net class HV_ACCU: +5V_ACCU, TS_N_ACCU, TS_P_ACCU
net class HV_VEHI: +5V_VEHI, TS_N_VEHI, TS_P_VEHI

### Notes on the sheet
- *isolated measurement of 0-600V to 0-3.38V
  *output to V_VEHIcle and V_ACCUumulator
  *high voltage range to be able to handle overvoltages from outside (charger)
- Car Number: 22
- IsoAmp Gain: 1V/V
  Pullup: 0.5mA output current (1mA limit)
  VoltDiv Gain: 1/180.86 = 596.8V/3.33V
  DANGER_V-threshold: 40V*(1/180.86) = 0.221V
  Actual divider: 0.217V -> 39.25V
- Title:
- Projekt:
- Revision:
- Author:
- Rules:
- Checked by:
- Sheet
- of
- Size:
- A4
- Date:
- Time:

### Library data of the parts
C22-C26 C28-C33 C70 C72 = SMD Capacitor: as C53 on sheet tsac-distribution
C27 C34 = SMD Capacitor: as C52 on sheet tsac-distribution
PS1 PS2 = R2S-2405/H: 2W DC/DC-Converter 'ECONOLINE' SMD 3kV unreg; V. In: 24; V. Out: 05; mA. Out: 400; Manufacturer: Recom; Nominal Input Voltage: 24V; Number of Outputs: 1; Min Input Voltage: 21.6V; Efficiency: 85%; Max Input Voltage: 26.4V; Voltage - Output 1: 5V; Max Output Current: 400mA; Supplier 1: Future Electronics; Manufacturer Part Number: R2S-2405/H; RoHS: Yes; Category: Voltage Regulators - Switching; Pricing 1: 39=17,02000, 78=14,04000, 117=13,79000, 156=13,62000 (USD); Mount: Surface Mount; Case/Package: SMD/SMT; Weight: 1.4g; Min Operating Temperature: -40°C; Max Operating Temperature: 100°C; Output Power: 2W; Packaging: Rail/Tube; Package Quantity: 39; Isolation Voltage: 3kV; Max Power Dissipation: 2W; Max Output Voltage: 5V; Features: SCP; Series: ECONOLINE R2S; Length: 12.75mm; Width: 10.7mm; Height: 8.7mm; RoHS Compliant: Yes; Lead Free: Lead Free; ComponentLink1URL: https://datasheet.ciiva.com/2177/r2s-r2d-2177940.pdf?src-supplier=Digi-Key; ComponentLink1Description: Datasheet; Supplier Part Number 1: 3107800
R14 R25-R30 R32 R33 = SMD Resistor: Resistor with multiple footprints
R24 R31 = CHV2512-FX-1005ELF: Res Thick Film 2512 10M Ohm 1% 1W ±100ppm/°C Molded SMD Paper T/R; Manufacturer: Bourns JW Miller; Voltage Rating: 4kV; Supplier 1: Digi-Key; Manufacturer Part Number: CHV2512-FX-1005ELF; RoHS: Yes; Category: Chip SMD Resistors; Stock 1: 27289; Pricing 1: 1=0,69000, 10=0,50800, 100=0,29600, 1000=0,16600 (USD); Mount: Surface Mount; Case/Package: 2512; Case Code (Metric): 6432; Case Code (Imperial): 2512; Min Operating Temperature: -55°C; Max Operating Temperature: 155°C; Power Rating: 1W; Packaging: Cut Tape; Resistor Type: Thick Film; Number of Terminations: 2; Termination: SMD/SMT; Max Power Dissipation: 1W; Temperature Coefficient: 100ppm/°C; Voltage Rating (DC): 4kV; Length: 0.126inch; Width: 0.252inch; Height: 0.03inch; Depth: 3.2mm; REACH SVHC: No SVHC; RoHS Compliant: Yes; ComponentLink1URL: http://www.farnell.com/datasheets/2059762.pdf?src-supplier=Farnell; ComponentLink1Description: http://www.farnell.com/datasheets/2059762.pdf?src-supplier=Farnell; ComponentLink2URL: http://www.alliedelec.com/images/products/datasheets/bm/BOURNS/70479526.pdf?src-supplier=Allied+Electronics; ComponentLink2Description: http://www.alliedelec.com/images/products/datasheets/bm/BOURNS/70479526.pdf?src-supplier=Allied+Electronics; ComponentLink3URL: http://uk.rs-online.com/webdocs/13ff/0900766b813ff012.pdf?src-supplier=RSComponents; ComponentLink3Description: http://uk.rs-online.com/webdocs/13ff/0900766b813ff012.pdf?src-supplier=RSComponents; ComponentLink4URL: http://www.farnell.com/datasheets/1889918.pdf?src-supplier=Newark; ComponentLink4Description: http://www.farnell.com/datasheets/1889918.pdf?src-supplier=Newark; ComponentLink5URL: http://www.farnell.com/datasheets/2059762.pdf?src-supplier=Element14; ComponentLink5Description: http://www.farnell.com/datasheets/2059762.pdf?src-supplier=Element14; ComponentLink6URL: http://www.bourns.com/docs/Product-Datasheets/CHV.pdf?src-supplier=Digi-Key; ComponentLink6Description: http://www.bourns.com/docs/Product-Datasheets/CHV.pdf?src-supplier=Digi-Key; ComponentLink7URL: http://www.bourns.com/data/global/pdfs/CHV.pdf?src-supplier=Avnet; ComponentLink7Description: http://www.bourns.com/data/global/pdfs/CHV.pdf?src-supplier=Avnet; Supplier Part Number 1: CHV2512-FX-1005ELFCT-ND
U14 U16 = ADUM3190: ANALOG DEVICES - ADUM3190ARQZ - Isolation Amplifier, High Stability Error, 2 Amplifier, 2.5 kV, 3V to 20V, QSOP, 16 Pins; Bandwidth: 10MHz; Max Input Voltage: 1.5V; Common Mode Rejection Ratio: 72dB; -3db Bandwidth: 400kHz; Input Offset Voltage (Vos): 2.5V; Number of Channels: 1; Isolation Voltage: 2.5kV; Input Bias Current: 10nA; Output Current per Channel: 2mA; Max Power Dissipation: 1.64W; Accuracy: 1%; Min Input Voltage: 400mV; Max Output Voltage: 5V; Nominal Supply Current: 2.9mA; Number of Amplifiers: 2; Supplier 1: Digi-Key; Manufacturer: Analog Devices; Manufacturer Part Number: ADUM3190ARQZ; RoHS: Yes; Category: Integrated Circuits (ICs); Stock 1: 9197; Pricing 1: 1=2,92000, 10=2,62400, 25=2,48040, 100=2,14970, 250=2,03944, 500=1,82998, 1000=1,71600 (USD); Mount: Surface Mount; Case/Package: QSOP; Number of Pins: 16; Contact Plating: Tin,Matte; Min Operating Temperature: -40°C; Max Operating Temperature: 85°C; Package Quantity: 98; Packaging: Rail/Tube; Max Supply Voltage: 20V; Min Supply Voltage: 3V; Gain Bandwidth Product: 10MHz; Min Output Voltage: 400mV; Series: iCoupler®; Supply Current: 2.9mA; Amplifier Type: ISOLATION; Power Dissipation: 1.64W; Length: 5mm; Width: 4.01mm; Height: 1.65mm; Radiation Hardening: No; Lead Free: Contains Lead; RoHS Compliant: Yes; REACH SVHC: No SVHC; ComponentLink1URL: https://datasheet.ciiva.com/15065/adum3190-preliminary-01-22-2013-15065104.pdf?src-supplier=Digi-Key; ComponentLink1Description: https://datasheet.ciiva.com/15065/adum3190-preliminary-01-22-2013-15065104.pdf?src-supplier=Digi-Key; ComponentLink2URL: https://datasheet.ciiva.com/22616/1692610-22616320.pdf?src-supplier=Element14; ComponentLink2Description: https://datasheet.ciiva.com/22616/1692610-22616320.pdf?src-supplier=Element14; ComponentLink3URL: https://datasheet.ciiva.com/29892/adum3190-29892631.pdf?src-supplier=Avnet; ComponentLink3Description: https://datasheet.ciiva.com/29892/adum3190-29892631.pdf?src-supplier=Avnet; Supplier Part Number 1: ADUM3190ARQZ-ND
U15 = ADCMP391ARZ: 2.3V-5.5V Single Comparator With Known Power-Up State and Open-Drain output

## Sheet imd-monitoring.SchDoc: imd-monitoring
size A4; Date: 05.10.2017; CheckedBy: UNCHECKED; Author: Leon Loeser; Organization: Baltic Racing; Address1: Zur Schwedenschanze 15; Address2: Haus 18; Address3: 18435 Stralsund; Revision: xx.xx; SheetNumber: 3; SheetTotal: 9; Rules: EV6.3; ProjectName: Projekt
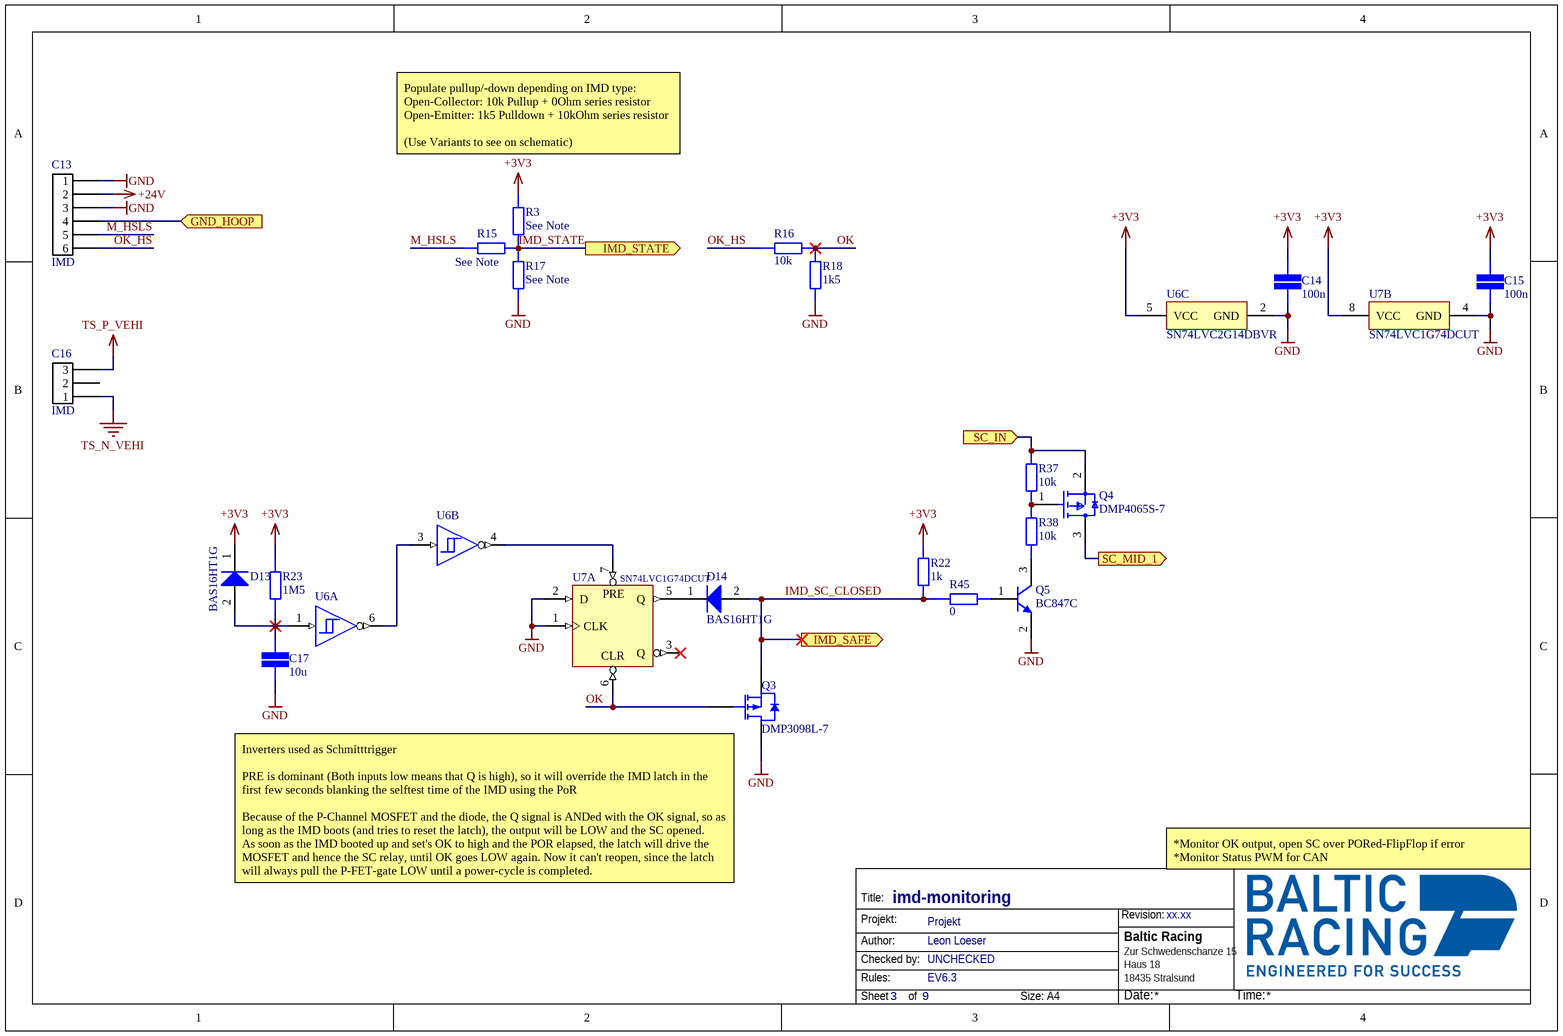
[diagram p4: imd-monitoring.SchDoc]

### Parts
C13  IMD  [43045-0612]
C14  value 100n  [CAP 0603/1608]  (hidden comment: SMD Capacitor)
C15  value 100n  [CAP 0603/1608]  (hidden comment: SMD Capacitor)
C16  IMD  [43650-0315]
C17  value 10u  [CAP 1206/3216]  (hidden comment: SMD Capacitor)
D13  BAS16HT1G  [ONSC-SOD-323-2-477-02_V]
D14  BAS16HT1G  [ONSC-SOD-323-2-477-02_V]
Q3  DMP3098L-7  [DIOD-SOT23-3_V]
Q4  DMP4065S-7  [FP-SOT23-MFG]
Q5  BC847C  [INF-SOT23_L]
R3  value See Note  [STACKPOLE CSR0603]  (hidden comment: SMD Resistor)
R15  value See Note  [STACKPOLE CSR0603]  (hidden comment: SMD Resistor)
R16  value 10k  [STACKPOLE CSR0603]  (hidden comment: SMD Resistor)
R17  value See Note  [STACKPOLE CSR0603]  (hidden comment: SMD Resistor)
R18  value 1k5  [STACKPOLE CSR0603]  (hidden comment: SMD Resistor)
R22  value 1k  [STACKPOLE CSR0603]  (hidden comment: SMD Resistor)
R23  value 1M5  [STACKPOLE CSR0603]  (hidden comment: SMD Resistor)
R37  value 10k  [STACKPOLE CSR0603]  (hidden comment: SMD Resistor)
R38  value 10k  [STACKPOLE CSR0603]  (hidden comment: SMD Resistor)
R45  value 0  [STACKPOLE CSR0603]  (hidden comment: SMD Resistor)
U6  SN74LVC2G14DBVR  [DBV0006A_M]  (value not drawn)  (parts A,B,C of 3)
U7  SN74LVC1G74DCUT  [DCU0008A_N]  (parts A,B of 2)

### Ports
GND_HOOP (in), IMD_SAFE (out), IMD_STATE (out), SC_IN (in), SC_MID_1 (out)

### Nets
+3V3: C14.1 C15.1 D13.1(K) R3.2 R22.2 R23.2 U6.5(VCC) U7.8(VCC)
+24V: C13.2
GND: C13.1 C13.3 C14.2 C15.2 C17.1 Q3.3(D) Q5.2(E) R17.1 R18.1 U6.2(GND) U7.1(CLK) U7.2(D) U7.4(GND)
TS_N_VEHI: C16.1
TS_P_VEHI: C16.3
GND_HOOP: C13.4 ; port GND_HOOP
IMD_SC_CLOSED: D14.2(A) Q3.2(S) R22.1 R45.2 ; port IMD_SAFE
IMD_STATE: R3.1 R15.1 R17.2 ; port IMD_STATE
M_HSLS: C13.5 R15.2
OK: Q3.1(G) R16.1 R18.2 U7.6(~{CLR})
OK_HS: C13.6 R16.2
SC_IN: Q4.2(S) R37.1 ; port SC_IN
NetC17_2: C17.2 D13.2(A) R23.1 U6.1(1A)
NetD14_1: D14.1(K) U7.5(Q)
NetQ4_1: Q4.1(G) R37.2 R38.1
NetQ4_3: Q4.3(D) ; port SC_MID_1
NetQ5_1: Q5.1(B) R45.1
NetQ5_3: Q5.3(C) R38.2
NetU6_3: U6.3(2A) U6.6(1Y)
NetU6_4: U6.4(2Y) U7.7(~{PRE})

Not connected (* = marked no-connect by the designer): C16 2; U7 3(Q)*

### Notes on the sheet
- Populate pullup/-down depending on IMD type:
  Open-Collector: 10k Pullup + 0Ohm series resistor
  Open-Emitter: 1k5 Pulldown + 10kOhm series resistor
  (Use Variants to see on schematic)
- (near Q3) Inverters used as Schmitttrigger
  PRE is dominant (Both inputs low means that Q is high), so it will override the IMD latch in the first few seconds blanking the selftest time of the IMD using the PoR
  Because of the P-Channel MOSFET and the diode, the Q signal is ANDed with the OK signal, so as long as the IMD boots (and tries to reset the latch), the output will be LOW and the SC opened.
  As soon as the IMD booted up and set's OK to high and the POR elapsed, the latch will drive the MOSFET and hence the SC relay, until OK goes LOW again. Now it can't reopen, since the latch will always pull the P-FET-gate LOW until a power-cycle is completed.
- *Monitor OK output, open SC over PORed-FlipFlop if error
  *Monitor Status PWM for CAN
- Title:
- Projekt:
- Revision:
- Author:
- Rules:
- Checked by:
- Sheet
- of
- Size:
- A4
- Date:
- Time:
- (in symbol CMP-0859-00687-3, part A) PRE; CLR

### Library data of the parts
C13 = MicroFit3.0 6-Pin: Molex MicroFit3.0 6-Pin
C14 C15 C17 = SMD Capacitor: as C53 on sheet tsac-distribution
C16 = MicroFit3.0 3-Pin: Molex MicroFit3.0 3-Pin
D13 D14 = CMP-1054-00068-1: as D1 on sheet air; Packing: Tape and Reel; ComponentLink2URL: http://www.onsemi.com/pub_link/Collateral/BAS16HT1-D.PDF; ComponentLink3Description: Package Specification; RoHS: TRUE; PackageDescription: 2-Pin SOD, Body 1.7 x 1.25 mm; PackageReference: SOD-323-2-477-02; PartNumber: BAS16HT1G; ComponentLink1URL: http://www.onsemi.com/; Mounting Technology: Surface Mount; ComponentLink1Description: Manufacturer URL; ComponentLink2Description: Datasheet; DatasheetVersion: Rev. 11; PackageVersion: Rev. H, 03/2007; ComponentLink3URL: http://www.onsemi.com/pub_link/Collateral/477-02.PDF.1
Q3 = CMP-0697-00001-2: P-Channel Enhancement Mode MOSFET, -30 V VDS, -55 to 155 degC, 3-Pin SOT23, RoHS, Tape and Reel; Manufacturer: Diodes Inc; PD (TA: 25 degC)=1.08 W; VGS: +/- 20 V; VDS: -30 V; IDS (TA: 25 degC)=-3.8 A; RDS(on) (Max.) (VGS: 4.5 V)=120 mOhm; VGS(th) (Max.): -2.1 V; ComponentLink3Description: Package Specification; ComponentLink3URL: http://www.diodes.com/datasheets/ap02002.pdf; PackageDescription: 3-Pin Small Outline Transistor, Body 1.3 x 2.9 mm, Pitch 0.95 mm; PackageReference: SOT23; PartNumber: DMP3098L-7; ComponentLink1Description: Manufacturer URL; ComponentLink2Description: Datasheet; ComponentLink2URL: http://www.diodes.com/datasheets/ds31447.pdf; ComponentLink1URL: http://www.diodes.com/; DatasheetVersion: Rev. 8 - 2; Mounting Technology: Surface Mount; RoHS: TRUE; Packing: Tape and Reel; PackageVersion: Rev. 75; Operating Temperature Range: -55 to 150 degC
Q4 = CMP-12801-000050-1: as Q6 on sheet ams; Octopart: https://octopart.com/dmp4065s-7-diodes+inc.-57605044; Footprint Url: https://www.diodes.com/assets/Package-Files/SOT23.pdf; Device Class L2: Transistors; Package: SOT23; Number Of P Channels: 1; ComponentLink2URL: https://www.diodes.com/assets/Datasheets/DMP4065S.pdf; Temperature Range High: +150°C; Device Class L1: Discrete Semiconductors; Temperature Range Low: -55°C; Manufacturer Part Number: DMP4065S-7; ComponentLink2Description: Datasheet; Lead Free: Yes; Temperature: -55°C to +150°C; Drain To Source Breakdown Voltage: -40V; Category: Trans; Height: 1.1mm; Digikey Description: MOSFET P-CH 40V 2.4A SOT23; Ipc Land Pattern Name: SOT92P240X102-3; Device Class L3: MOSFETs; RoHS: TRUE; Mouser Description: Trans MOSFET P-CH 40V 2.4A Automotive 3-Pin SOT-23 T/R; Automotive: No
Q5 = CMP-1177-00037-1: as Q7 on sheet ams; PartNumber: BC847C; ComponentLink3URL: http://www.infineon.com/dgdl/SOT23-Package_Overview.pdf?folderId=db3a30431936bc4b0119532290053c66&fileId=db3a30431936bc4b0119533468123c85; ComponentLink3Description: Package Specification; Mounting Technology: Surface Mount; PackageDescription: 3-Pin Small Outline Transistor Package, 1.3 x 2.9 mm Body, 0.95 mm Pitch; PackageReference: SOT23; ComponentLink2URL: http://www.infineon.com/dgdl/bc847series_bc848series_bc849series_bc850series.pdf?folderId=db3a304314dca389011541d30fa21656&fileId=db3a304314dca389011541d4630a1657; ComponentLink2Description: Datasheet; ComponentLink1Description: Manufacturer URL; Polarity: NPN; ComponentLink1URL: http://www.infineon.com/; IBM (max): 200Â mA; Packing: Reel; PackageVersion: Apr-08
R3 R15-R18 R22 R23 R37 R38 R45 = SMD Resistor: Resistor with multiple footprints
U6 = CMP-0859-00232-4: Dual Schmitt-Trigger Inverter, DBV0006A, LARGE T&R; Manufacturer: Texas Instruments; Voltage(Nom)(V): 1.8,2.5,3.3,5; Sub-Family: Inverting Buffer/Driver; ICC @ Nom Voltage(Max)(mA): 0.01; tpd @ Nom Voltage(Max)(ns): 9.5,5.7,5.4,4.3; Schmitt Trigger: Yes; Rating: Catalog; Bits(#): 2; Technology Family: LVC; Output Drive (IOL/IOH)(Max)(mA): 32/-32; VCC(Max)(V): 5.5; Output Type: CMOS; F @ Nom Voltage(Max)(Mhz): 150; Input Type: CMOS/TTL; Logic: Inverting; 3-State Output: No; VCC(Min)(V): 1.65; DatasheetVersion: SCES200M; Generic Part Number: SN74LVC2G14; PackageReference: DBV0006A; Operating Temperature Range(C): -40 to 125
U7 = CMP-0859-00687-3: Single Positive-Edge-Triggered D-Type Flip-Flop With Clear and Preset, DCU0008A, SMALL T&R; Manufacturer: Texas Instruments; Schmitt Trigger: No; Technology Family: LVC; VCC(Min)(V): 1.65; F @ Nom Voltage(Max)(Mhz): 150; ICC @ Nom Voltage(Max)(mA): 0.01; Voltage(Nom)(V): 1.8,2.5,3.3,5; VCC(Max)(V): 5.5; Output Type: CMOS; Logic: True; tpd @ Nom Voltage(Max)(ns): 13.4,7.1,5.9,4.1; Input Type: CMOS/TTL; Output Drive (IOL/IOH)(Max)(mA): 32/-32; Rating: Catalog; Bits(#): 1; Operating Temperature Range(C): -40 to 125; PackageReference: DCU0008A; DatasheetVersion: SCES794E; Sub-Family: D-Type Flip-Flop; 3-State Output: No; Generic Part Number: SN74LVC1G74

## Sheet microcontroller.SchDoc: microcontroller
size A4; Date: 05.10.2017; CheckedBy: UNCHECKED; Author: Leon Loeser; Organization: Baltic Racing; Address1: Zur Schwedenschanze 15; Address2: Haus 18; Address3: 18435 Stralsund; Revision: xx.xx; SheetNumber: 8; SheetTotal: 9; Rules: TODO; ProjectName: Projekt
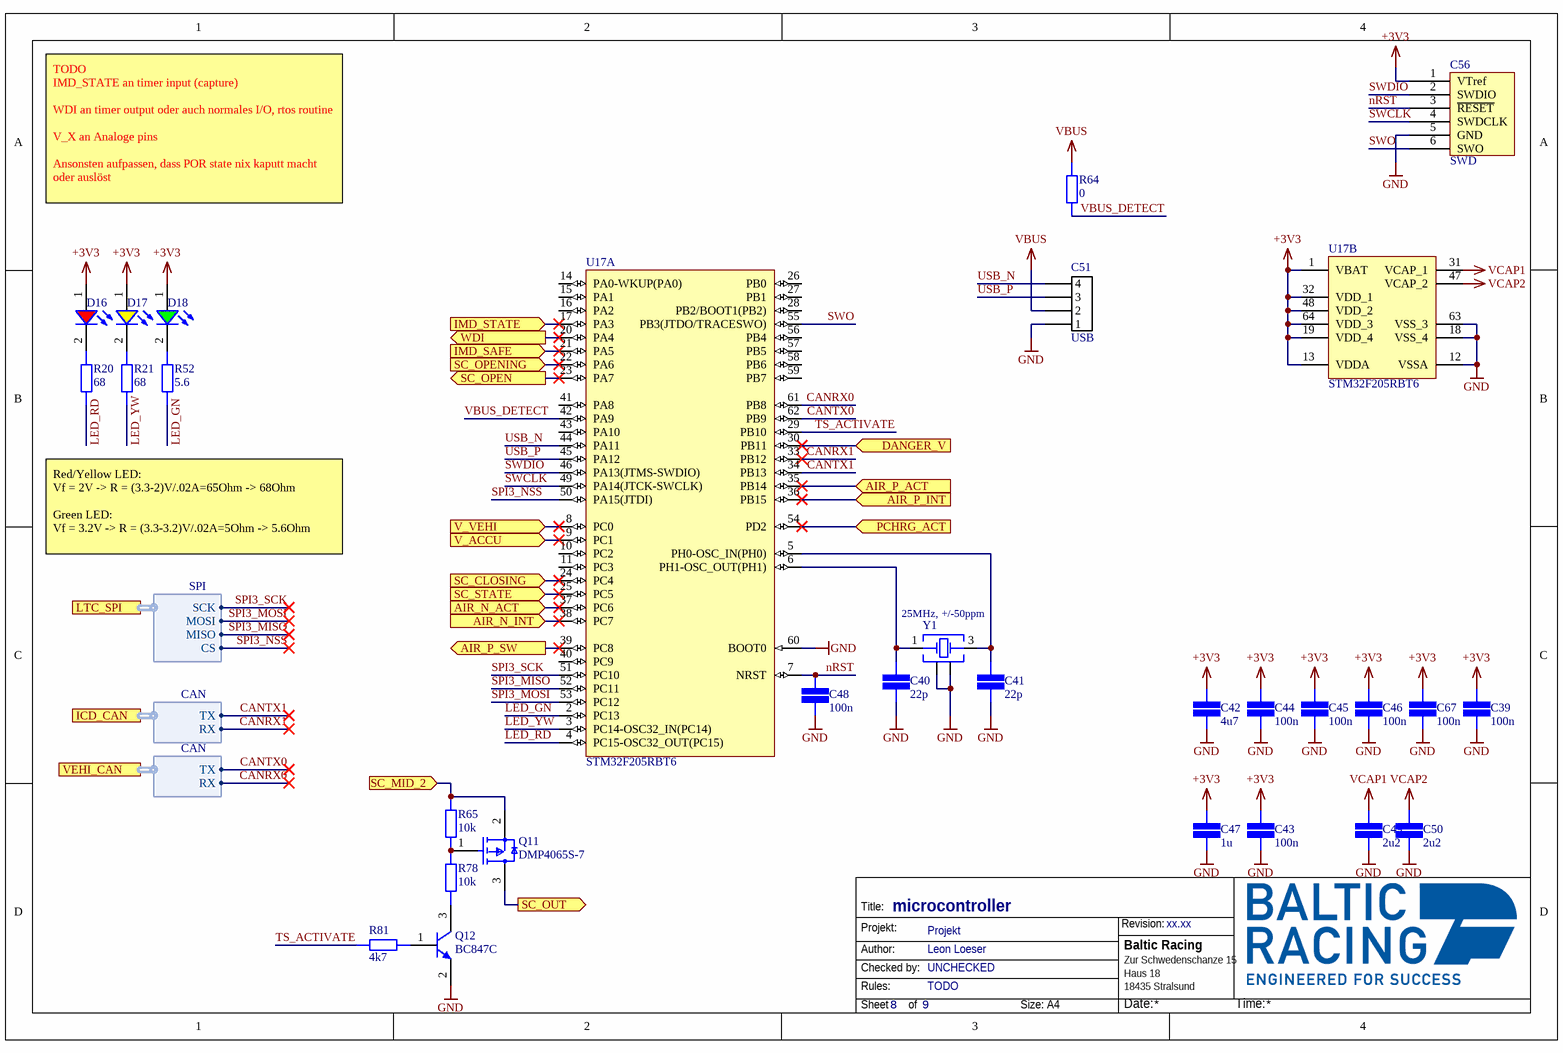
[diagram p5: microcontroller.SchDoc]

### Parts
C39  value 100n  [CAP 0603/1608]  (hidden comment: SMD Capacitor)
C40  value 22p  [CAP 0603/1608]  (hidden comment: SMD Capacitor)
C41  value 22p  [CAP 0603/1608]  (hidden comment: SMD Capacitor)
C42  value 4u7  [CAP 0805/2012]  (hidden comment: SMD Capacitor)
C43  value 100n  [CAP 0603/1608]  (hidden comment: SMD Capacitor)
C44  value 100n  [CAP 0603/1608]  (hidden comment: SMD Capacitor)
C45  value 100n  [CAP 0603/1608]  (hidden comment: SMD Capacitor)
C46  value 100n  [CAP 0603/1608]  (hidden comment: SMD Capacitor)
C47  value 1u  [CAP 0805/2012]  (hidden comment: SMD Capacitor)
C48  value 100n  [CAP 0603/1608]  (hidden comment: SMD Capacitor)
C49  value 2u2  [CAP 0805/2012]  (hidden comment: SMD Capacitor)
C50  value 2u2  [CAP 0805/2012]  (hidden comment: SMD Capacitor)
C51  USB  [43045-0412]
C56  SWD  [SEGGER_6_PIN]  (no BOM)
C67  value 100n  [CAP 0603/1608]  (hidden comment: SMD Capacitor)
D16  Red, 2 V, 140 deg  [WL-SMCW_0603_H=0.25]  (value not drawn)
D17  Yellow, 2 V, 140 deg  [WL-SMCW_0603_H=0.25]  (value not drawn)
D18  Green, 3.2 V, 140 deg  [WL-SMCW_0603_H=0.25]  (value not drawn)
Q11  DMP4065S-7  [FP-SOT23-MFG]
Q12  BC847C  [INF-SOT23_L]
R20  value 68  [STACKPOLE CSR0603]  (hidden comment: SMD Resistor)
R21  value 68  [STACKPOLE CSR0603]  (hidden comment: SMD Resistor)
R52  value 5.6  [STACKPOLE CSR0603]  (hidden comment: SMD Resistor)
R64  value 0  [STACKPOLE CSR0603]  (hidden comment: SMD Resistor)
R65  value 10k  [STACKPOLE CSR0603]  (hidden comment: SMD Resistor)
R78  value 10k  [STACKPOLE CSR0603]  (hidden comment: SMD Resistor)
R81  value 4k7  [STACKPOLE CSR0603]  (hidden comment: SMD Resistor)
U17  STM32F205RBT6  [STM-LQFP64_L]  (parts A,B of 2)
Y1  25MHz, +/-50ppm  [WE-XTAL_CFPX-180]

### Ports
AIR_N_ACT (in), AIR_N_INT (in), AIR_P_ACT (in), AIR_P_INT (in), AIR_P_SW (out), DANGER_V (in), ICD_CAN (harness CAN), IMD_SAFE (in), IMD_STATE (in), LTC_SPI (harness SPI), PCHRG_ACT (in), SC_CLOSING (in), SC_MID_2 (in), SC_OPEN (out), SC_OPENING (in), SC_OUT (out), SC_STATE (in), V_ACCU (in), V_VEHI (in), VEHI_CAN (harness CAN), WDI (out)

### Harnesses
CAN: TX, RX
SPI: SCK, MOSI, MISO, CS

### Nets
+3V3: C39.2 C42.2 C43.2 C44.2 C45.2 C46.2 C47.2 C56.1(VTref) C67.2 D16.1(A) D17.1(A) D18.1(A) U17.1(VBAT) U17.13(VDDA) U17.19(VDD_4) U17.32(VDD_1) U17.48(VDD_2) U17.64(VDD_3)
GND: C39.1 C40.1 C41.1 C42.1 C43.1 C44.1 C45.1 C46.1 C47.1 C48.1 C49.1 C50.1 C51.1 C56.5(GND) C67.1 Q12.2(E) U17.12(VSSA) U17.18(VSS_4) U17.60(BOOT0) U17.63(VSS_3) Y1.2(GND) Y1.4(GND)
VBUS: C51.2 R64.2
VCAP1: C49.2 U17.31(VCAP_1)
VCAP2: C50.2 U17.47(VCAP_2)
AIR_N_ACT: U17.37(PC6) ; port AIR_N_ACT
AIR_N_INT: U17.38(PC7) ; port AIR_N_INT
AIR_P_ACT: U17.35(PB14) ; port AIR_P_ACT
AIR_P_INT: U17.36(PB15) ; port AIR_P_INT
CANRX0: U17.61(PB8) ; port VEHI_CAN.RX
CANRX1: U17.33(PB12) ; port ICD_CAN.RX
CANTX0: U17.62(PB9) ; port VEHI_CAN.TX
CANTX1: U17.34(PB13) ; port ICD_CAN.TX
DANGER_V: U17.30(PB11) ; port DANGER_V
IMD_SC_CLOSED: U17.21(PA5) ; port IMD_SAFE
IMD_STATE: U17.17(PA3) ; port IMD_STATE
LED_GN: R52.1 U17.2(PC13)
LED_RD: R20.1 U17.4(PC15-OSC32_OUT(PC15))
LED_YW: R21.1 U17.3(PC14-OSC32_IN(PC14))
nRST: C48.2 C56.3(~{RESET}) U17.7(NRST)
PCHRG_ACT: U17.54(PD2) ; port PCHRG_ACT
SC_OUT: Q11.3(D) ; port SC_OUT
SPI3_MISO: U17.52(PC11) ; port LTC_SPI.MISO
SPI3_MOSI: U17.53(PC12) ; port LTC_SPI.MOSI
SPI3_NSS: U17.50(PA15(JTDI)) ; port LTC_SPI.CS
SPI3_SCK: U17.51(PC10) ; port LTC_SPI.SCK
SWCLK: C56.4(SWDCLK) U17.49(PA14(JTCK-SWCLK))
SWDIO: C56.2(SWDIO) U17.46(PA13(JTMS-SWDIO))
SWO: C56.6(SWO) U17.55(PB3(JTDO/TRACESWO))
TS_ACTIVATE: R81.2 U17.29(PB10)
USB_N: C51.4 U17.44(PA11)
USB_P: C51.3 U17.45(PA12)
V_ACCU: U17.9(PC1) ; port V_ACCU
V_VEHI: U17.8(PC0) ; port V_VEHI
VBUS_DETECT: R64.1 U17.42(PA9)
WDI: U17.20(PA4) ; port WDI
NetC40_2: C40.2 U17.6(PH1-OSC_OUT(PH1)) Y1.1(Crystal)
NetC41_2: C41.2 U17.5(PH0-OSC_IN(PH0)) Y1.3(Crystal)
NetD3_2: U17.24(PC4) ; port SC_CLOSING
NetD4_1: U17.25(PC5) ; port SC_STATE
NetD5_1: U17.23(PA7) ; port SC_OPEN
NetD7_1: U17.22(PA6) ; port SC_OPENING
NetD16_2: D16.2(K) R20.2
NetD17_2: D17.2(K) R21.2
NetD18_2: D18.2(K) R52.2
NetQ6_3: Q11.2(S) R65.1 ; port SC_MID_2
NetQ11_1: Q11.1(G) R65.2 R78.1
NetQ12_1: Q12.1(B) R81.1
NetQ12_3: Q12.3(C) R78.2
NetR19_1: U17.39(PC8) ; port AIR_P_SW

Not connected (* = marked no-connect by the designer): U17 10(PC2) 11(PC3) 14(PA0-WKUP(PA0)) 15(PA1) 16(PA2) 26(PB0) 27(PB1) 28(PB2/BOOT1(PB2)) 40(PC9) 41(PA8) 43(PA10) 56(PB4) 57(PB5) 58(PB6) 59(PB7)

### Notes on the sheet
- TODO
  IMD_STATE an timer input (capture)
  WDI an timer output oder auch normales I/O, rtos routine
  V_X an Analoge pins
  Ansonsten aufpassen, dass POR state nix kaputt macht oder auslöst
- Red/Yellow LED:
  Vf = 2V -> R = (3.3-2)V/.02A=65Ohm -> 68Ohm
  Green LED:
  Vf = 3.2V -> R = (3.3-3.2)V/.02A=5Ohm -> 5.6Ohm
- Title:
- Projekt:
- Revision:
- Author:
- Rules:
- Checked by:
- Sheet
- of
- Size:
- A4
- Date:
- Time:

### Library data of the parts
C39-C50 C67 = SMD Capacitor: as C53 on sheet tsac-distribution
C51 = MicroFit3.0 4-Pin: Molex Micro-Fit 3.0 4-Pin / 600V / 8.5V
C56 = Segger 6-Pin
D16 = 150060RS75020: SMT Mono-color Chip LED Waterclear WL-SMCW, size 0603, Red, 2 V, 140 deg, 100 mcd; Forward Voltage: 2 V; Viewing Angle: 140 deg; Peak Wavelength: 630 nm; Dominant Wavelength: 625 nm; Luminous Intensity: 100 mcd; Chip Technology: AlInGaP; ComponentLink1Description: Manufacturer; ComponentLink1URL: http://www.we-online.de; ComponentLink2Description: Datasheet; ComponentLink2URL: https://katalog.we-online.de/led/datasheet/150060RS75020.pdf; Part Number: 150060RS75020; Published Date: November 2018; Publisher: Wurth Elektronik; Size: 0603; Operating Temperature: -40 to 85 degC; Emitting Color: Red; Mounting Technology: SMT; Packaging: Tape and Reel
D17 = 150060YS75020: SMT Mono-color Chip LED Waterclear WL-SMCW, size 0603, Yellow, 2 V, 140 deg, 130 mcd; Forward Voltage: 2 V; Viewing Angle: 140 deg; Peak Wavelength: 595 nm; Dominant Wavelength: 590 nm; Luminous Intensity: 130 mcd; Chip Technology: AlInGaP; ComponentLink1Description: Manufacturer; ComponentLink1URL: http://www.we-online.de; ComponentLink2Description: Datasheet; ComponentLink2URL: https://katalog.we-online.de/led/datasheet/150060YS75020.pdf; Part Number: 150060YS75020; Published Date: November 2018; Publisher: Wurth Elektronik; Size: 0603; Operating Temperature: -40 to 85 degC; Emitting Color: Yellow; Mounting Technology: SMT; Packaging: Tape and Reel
D18 = 150060GS75020: SMT Mono-color Chip LED Waterclear WL-SMCW, size 0603, Green, 3.2 V, 140 deg, 700 mcd; Forward Voltage: 3.2 V; Viewing Angle: 140 deg; Peak Wavelength: 515 nm; Dominant Wavelength: 525 nm; Luminous Intensity: 700 mcd; Chip Technology: InGaN; ComponentLink1Description: Manufacturer; ComponentLink1URL: http://www.we-online.de; ComponentLink2Description: Datasheet; ComponentLink2URL: https://katalog.we-online.de/led/datasheet/150060GS75020.pdf; Part Number: 150060GS75020; Published Date: November 2018; Publisher: Wurth Elektronik; Size: 0603; Operating Temperature: -40 to 85 degC; Emitting Color: Green; Mounting Technology: SMT; Packaging: Tape and Reel
Q11 = CMP-12801-000050-1: as Q6 on sheet ams; Octopart: https://octopart.com/dmp4065s-7-diodes+inc.-57605044; Footprint Url: https://www.diodes.com/assets/Package-Files/SOT23.pdf; Device Class L2: Transistors; Package: SOT23; Number Of P Channels: 1; ComponentLink2URL: https://www.diodes.com/assets/Datasheets/DMP4065S.pdf; Temperature Range High: +150°C; Device Class L1: Discrete Semiconductors; Temperature Range Low: -55°C; Manufacturer Part Number: DMP4065S-7; ComponentLink2Description: Datasheet; Lead Free: Yes; Temperature: -55°C to +150°C; Drain To Source Breakdown Voltage: -40V; Category: Trans; Height: 1.1mm; Digikey Description: MOSFET P-CH 40V 2.4A SOT23; Ipc Land Pattern Name: SOT92P240X102-3; Device Class L3: MOSFETs; RoHS: TRUE; Mouser Description: Trans MOSFET P-CH 40V 2.4A Automotive 3-Pin SOT-23 T/R; Automotive: No
Q12 = CMP-1177-00037-1: as Q7 on sheet ams; PartNumber: BC847C; ComponentLink3URL: http://www.infineon.com/dgdl/SOT23-Package_Overview.pdf?folderId=db3a30431936bc4b0119532290053c66&fileId=db3a30431936bc4b0119533468123c85; ComponentLink3Description: Package Specification; Mounting Technology: Surface Mount; PackageDescription: 3-Pin Small Outline Transistor Package, 1.3 x 2.9 mm Body, 0.95 mm Pitch; PackageReference: SOT23; ComponentLink2URL: http://www.infineon.com/dgdl/bc847series_bc848series_bc849series_bc850series.pdf?folderId=db3a304314dca389011541d30fa21656&fileId=db3a304314dca389011541d4630a1657; ComponentLink2Description: Datasheet; ComponentLink1Description: Manufacturer URL; Polarity: NPN; ComponentLink1URL: http://www.infineon.com/; IBM (max): 200Â mA; Packing: Reel; PackageVersion: Apr-08
R20 R21 R52 R64 R65 R78 R81 = SMD Resistor: Resistor with multiple footprints
U17 = CMP-0237-00091-3: ARM Cortex-M3 32-bit MCU, 128 KB Flash, 64 KB Internal RAM, 51 I/Os, 64-pin LQFP, -40 to 85 degC, Tray; Supply Voltage(Vcc) min (V): 1.8; D/A Converter: 2x12-bit (2 Channel); I/Os (High Current): 51; Internal RAM Size (kB): 64; FLASH Size (Prog) (kB): 128; Operating Frequency(F) (Processor speed) (MHz): 120; ComponentLink1Description: Manufacturer URL; DatasheetVersion: Rev. 9; PartNumber: STM32F205RBT6; ComponentLink1URL: http://www.st.com/web/en/home.html; Core: ARM Cortex-M3; ComponentLink3Description: Package Specification; Packing: Tray; PackageReference: LQFP64; Mounting Technology: Surface Mount; ComponentLink2Description: Datasheet; PackageVersion: Rev. 4, 06/2013; PackageDescription: 64-Pin Low Profile Quad Flat Package, 10 x 10 mm Body, 0.5 mm Pitch; ComponentLink2URL: http://www.st.com/st-web-ui/static/active/en/resource/technical/document/datasheet/CD00237391.pdf; ComponentLink3URL: http://www.st.com/st-web-ui/static/active/en/resource/technical/document/datasheet/DM00037051.pdf
Y1 = 830035268: WE-XTAL Quartz Crystal, SMT, CFPX-180, 25MHz, +/-50ppm; Load Capacitance: 16pF; ComponentLink1Description: Manufacturer; ComponentLink1URL: http://www.we-online.de; ComponentLink2Description: Datasheet; ComponentLink2URL: https://katalog.we-online.com/pbs/datasheet/830035268.pdf; Operating Temperature: -10 to +60degC; Packaging: Tape and Reel; Part Number: 830035268; Published Date: November 2019; Size: CFPX-180; Frequency Stability: +/-50ppm; Frequency: 25MHz; Frequency Tolerance: +/-50ppm; Mounting Technology: SMT; Publisher: Wurth Elektronik